# EAGLE design SensorInterface (EAGLE 7.6.0)

## Sheet 1 of 2
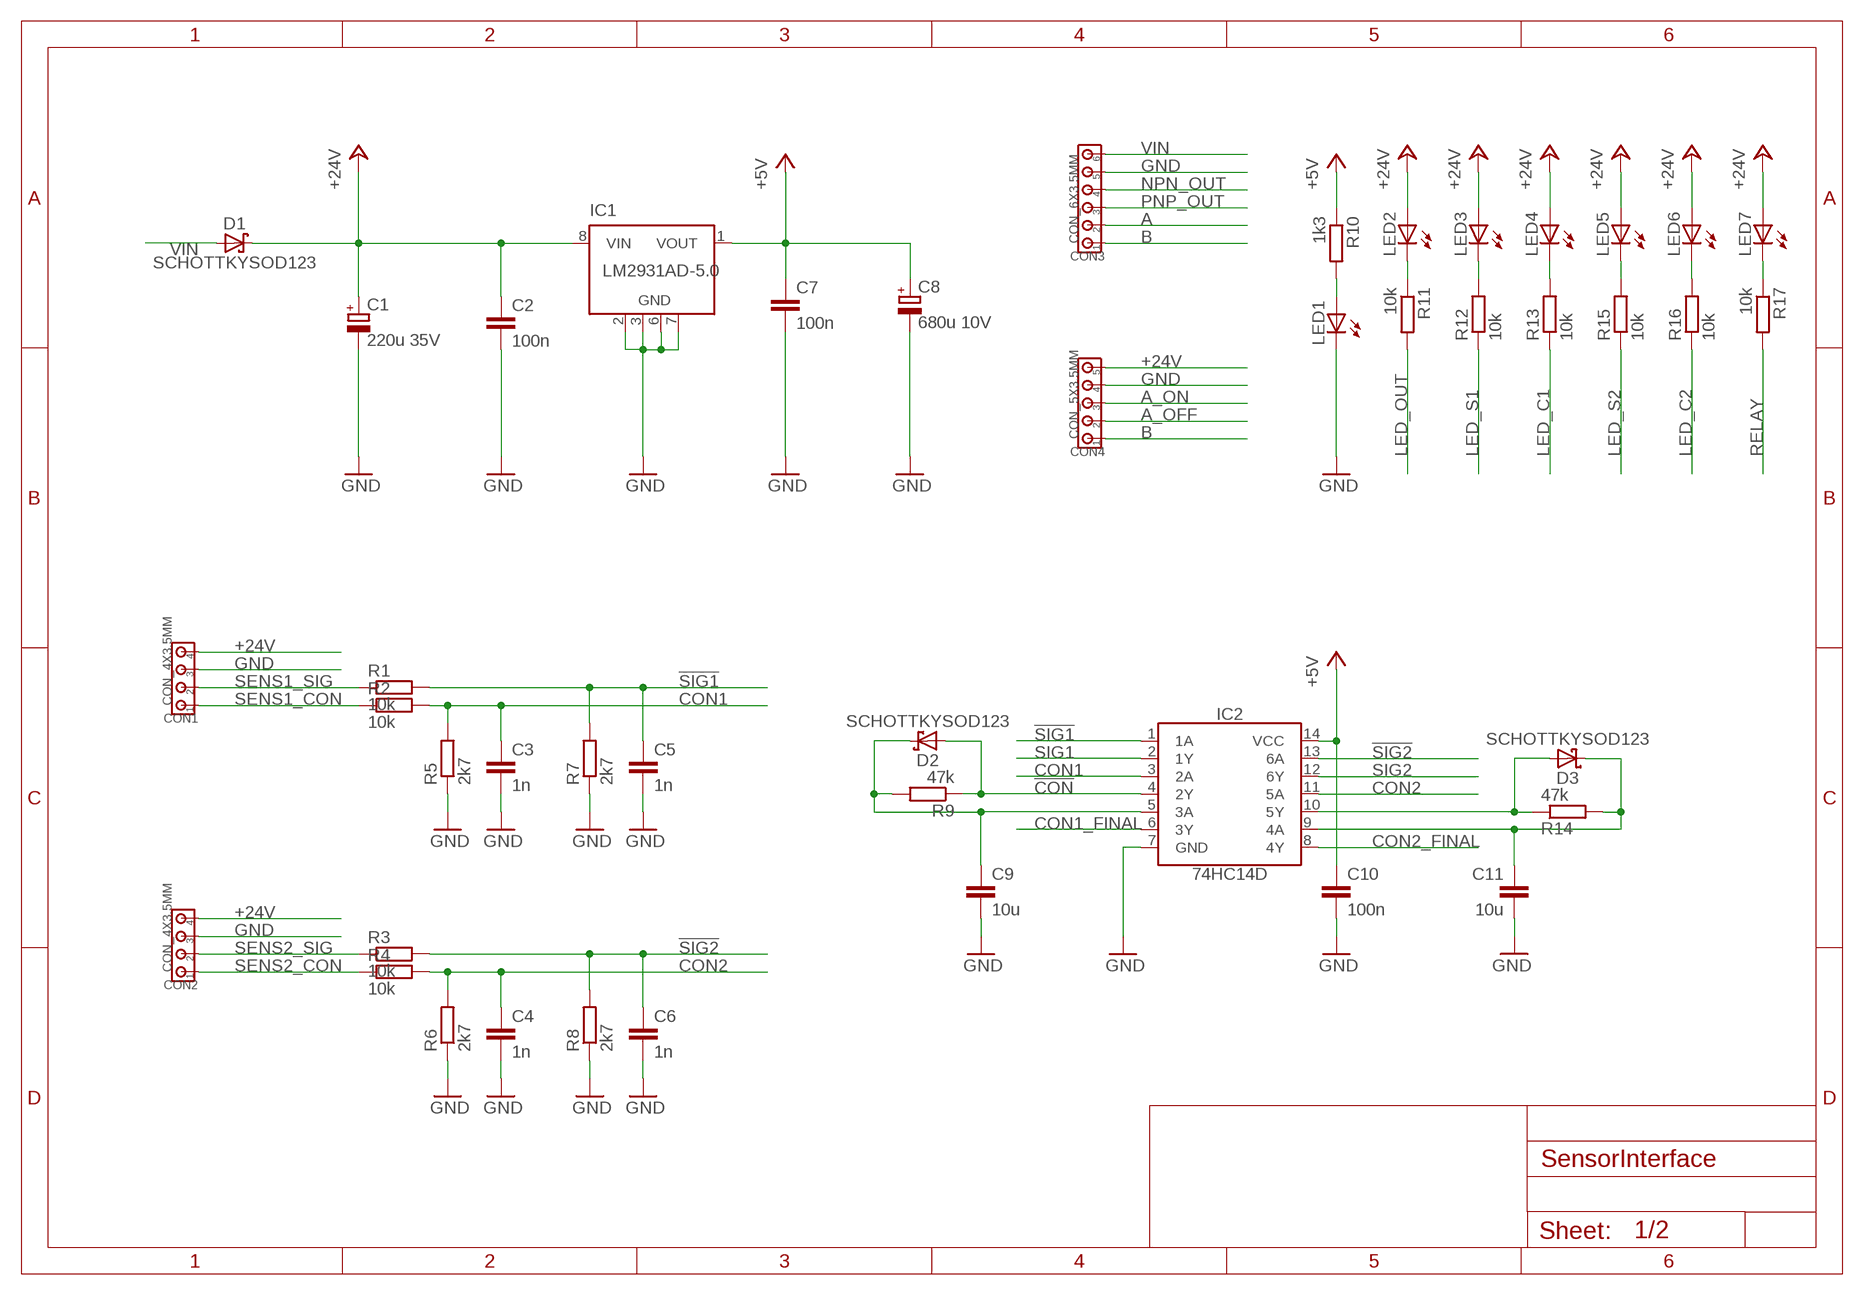
[diagram p0: schematic, sheet 1]

### Parts
C1  220u 35V  C_POLARIZED8MM  [8MM]
C2  100n  CC0805  [C0805]
C3  1n  CC0805  [C0805]
C4  1n  CC0805  [C0805]
C5  1n  CC0805  [C0805]
C6  1n  CC0805  [C0805]
C7  100n  CC0805  [C0805]
C8  680u 10V  C_POLARIZED8MM  [8MM]
C9  10u  CC0805  [C0805]
C10  100n  CC0805  [C0805]
C11  10u  CC0805  [C0805]
CON1  CON_4X3.5MM  [3.5MM_4X]
CON2  CON_4X3.5MM  [3.5MM_4X]
CON3  CON_6X3.5MM  [3.5MM_6X]
CON4  CON_5X3.5MM  [3.5MM_5X]
D1  SCHOTTKYSOD123  [SOD123]
D2  SCHOTTKYSOD123  [SOD123]
D3  SCHOTTKYSOD123  [SOD123]
IC1  LM2931AD-5.0  [SOIC8]
IC2  74HC14D  [SO14]
LED1  LED0805_NB  [LED0805_NOBOARDER]
LED2  LED0805_NB  [LED0805_NOBOARDER]
LED3  LED0805_NB  [LED0805_NOBOARDER]
LED4  LED0805_NB  [LED0805_NOBOARDER]
LED5  LED0805_NB  [LED0805_NOBOARDER]
LED6  LED0805_NB  [LED0805_NOBOARDER]
LED7  LED0805_NB  [LED0805_NOBOARDER]
R1  10k  RESISTORR0805  [R0805]
R2  10k  RESISTORR0805  [R0805]
R3  10k  RESISTORR0805  [R0805]
R4  10k  RESISTORR0805  [R0805]
R5  2k7  RESISTORR0805  [R0805]
R6  2k7  RESISTORR0805  [R0805]
R7  2k7  RESISTORR0805  [R0805]
R8  2k7  RESISTORR0805  [R0805]
R9  47k  RESISTORR0805  [R0805]
R10  1k3  RESISTORR0805  [R0805]
R11  10k  RESISTORR0805  [R0805]
R12  10k  RESISTORR0805  [R0805]
R13  10k  RESISTORR0805  [R0805]
R14  47k  RESISTORR0805  [R0805]
R15  10k  RESISTORR0805  [R0805]
R16  10k  RESISTORR0805  [R0805]
R17  10k  RESISTORR0805  [R0805]

### Nets
!CON!: D2.A IC2.4(2Y) R9.1
!CON!1: D3.A IC2.10(5Y) R14.1
!SIG1!: C5.1 IC2.1(1A) R1.2 R7.2 ; also sheet 2
!SIG2!: C6.1 IC2.13(6A) R3.2 R8.2 ; also sheet 2
+5V: C7.1 C8.+ C10.1 IC1.1(VOUT) IC2.14(VCC) R10.1 ; also sheet 2
+24V: C1.+ C2.1 CON1.4 CON2.4 CON4.5 D1.C IC1.8(VIN) LED2.A LED3.A LED4.A LED5.A LED6.A LED7.A ; also sheet 2
A: CON3.2 ; also sheet 2
A_OFF: CON4.2 ; also sheet 2
A_ON: CON4.3 ; also sheet 2
B: CON3.1 CON4.1
CON1: C3.1 IC2.3(2A) R2.2 R5.2
CON1_FINAL: IC2.6(3Y) ; also sheet 2
CON2: C4.1 IC2.11(5A) R4.2 R6.2
CON2_FINAL: IC2.8(4Y) ; also sheet 2
GND: C1.- C2.2 C3.2 C4.2 C5.2 C6.2 C7.2 C8.- C9.2 C10.2 C11.2 CON1.3 CON2.3 CON3.5 CON4.4 IC1.2(GND) IC1.3(GND) IC1.6(GND) IC1.7(GND) IC2.7(GND) LED1.C R5.1 R6.1 R7.1 R8.1 ; also sheet 2
LED_C1: R13.1 ; also sheet 2
LED_C2: R16.1 ; also sheet 2
LED_OUT: R11.2 ; also sheet 2
LED_S1: R12.1 ; also sheet 2
LED_S2: R15.1 ; also sheet 2
N$2: C11.1 D3.C IC2.9(4A) R14.2
N$4: C9.1 D2.C IC2.5(3A) R9.2
N$6: LED1.A R10.2
N$8: LED2.C R11.1
N$11: LED7.C R17.1
N$12: LED6.C R16.2
N$13: LED5.C R15.2
N$14: LED4.C R13.2
N$15: LED3.C R12.2
NPN_OUT: CON3.4 ; also sheet 2
PNP_OUT: CON3.3 ; also sheet 2
RELAY: R17.2 ; also sheet 2
SENS1_CON: CON1.1 R2.1
SENS1_SIG: CON1.2 R1.1
SENS2_CON: CON2.1 R4.1
SENS2_SIG: CON2.2 R3.1
SIG1: IC2.2(1Y) ; also sheet 2
SIG2: IC2.12(6Y) ; also sheet 2
VIN: CON3.6 D1.A

## Sheet 2 of 2
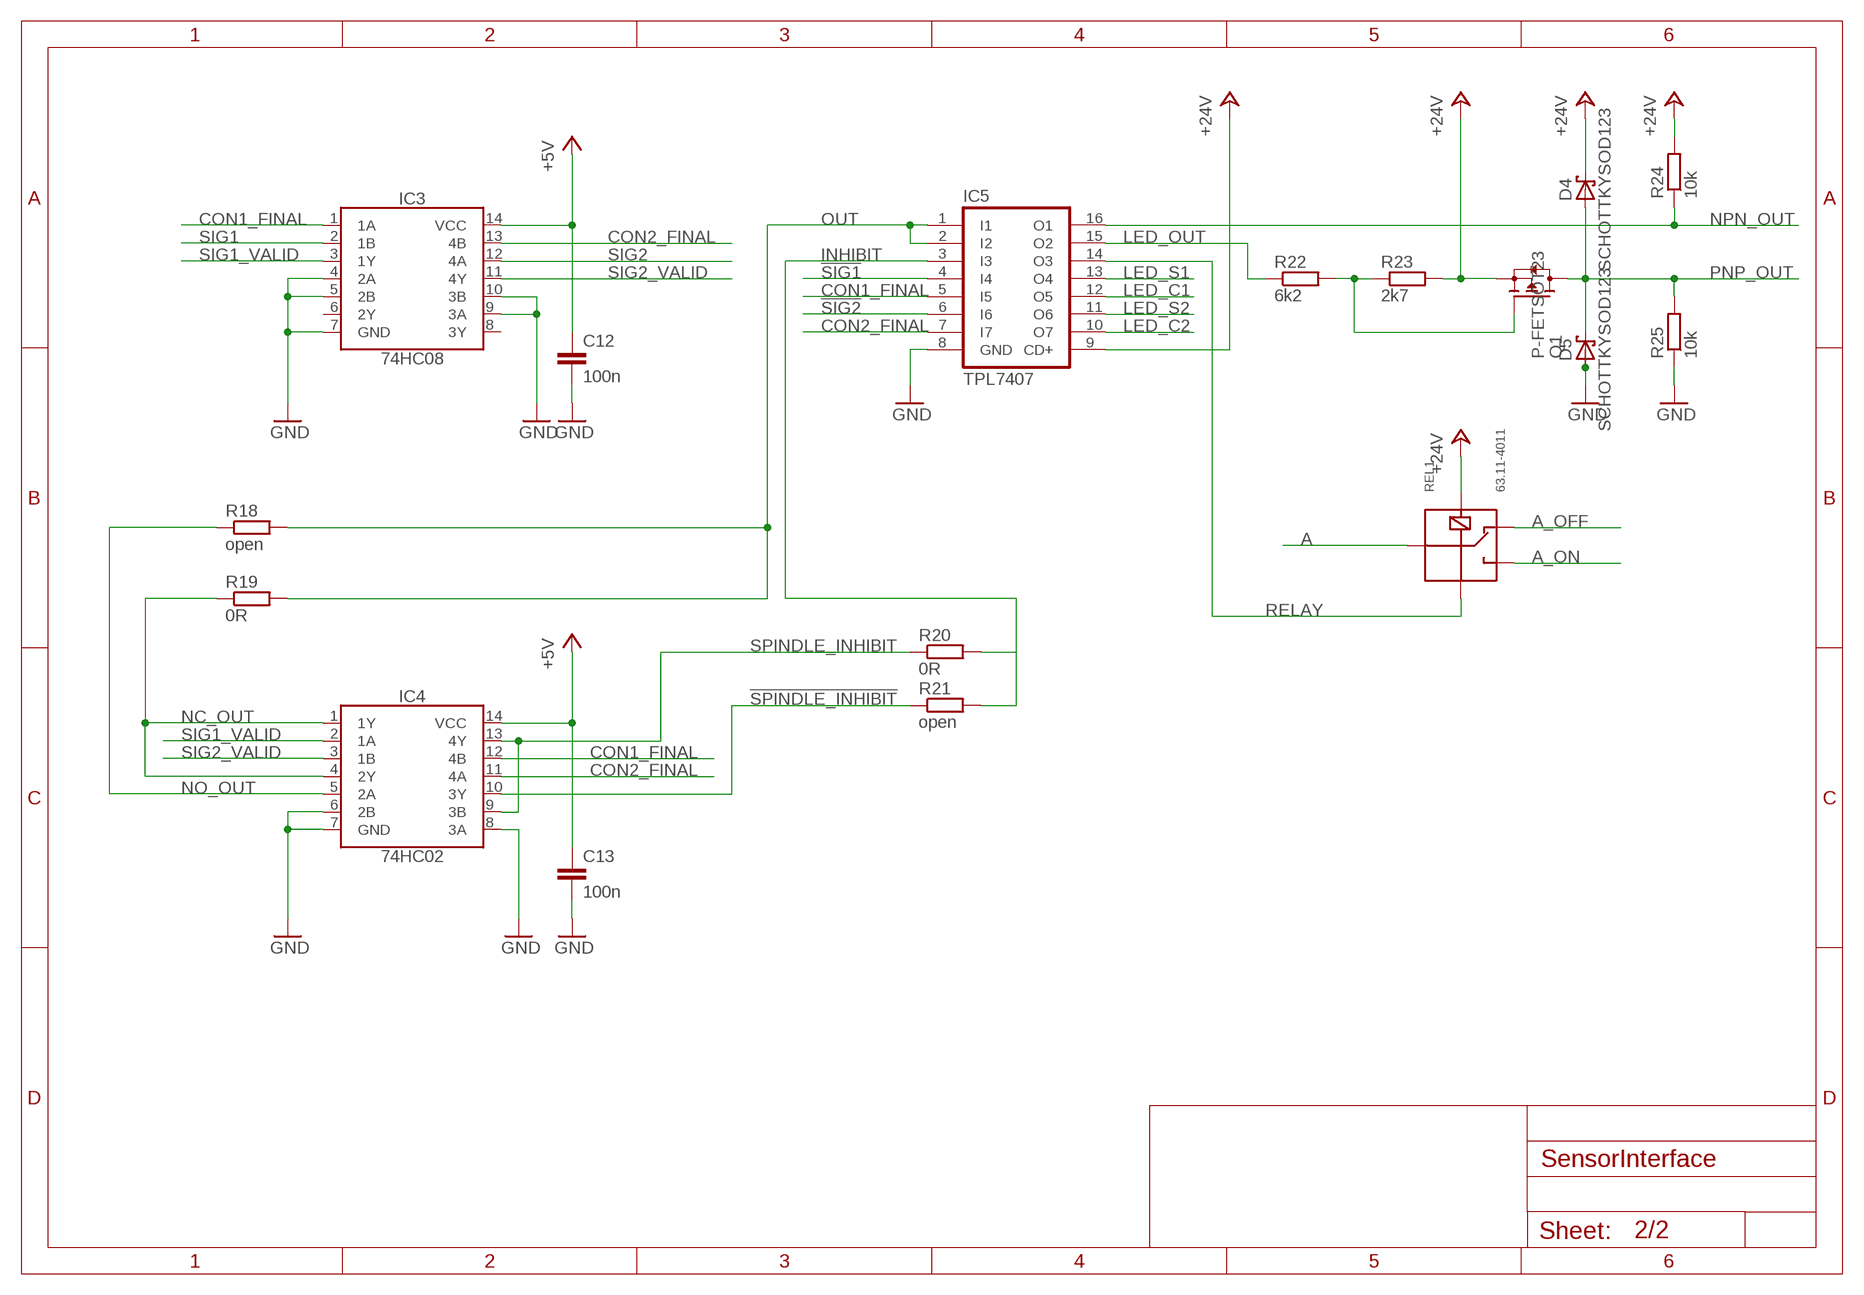
[diagram p1: schematic, sheet 2]

### Parts
C12  100n  CC0805  [C0805]
C13  100n  CC0805  [C0805]
D4  SCHOTTKYSOD123  [SOD123]
D5  SCHOTTKYSOD123  [SOD123]
IC3  74HC08  [SO14]
IC4  74HC02  [SO14]
IC5  TPL7407  ULN2003  [SO16]
Q1  P-FETSOT23  [SOT23]
R18  open  RESISTORR0805  [R0805]
R19  0R  RESISTORR0805  [R0805]
R20  0R  RESISTORR0805  [R0805]
R21  open  RESISTORR0805  [R0805]
R22  6k2  RESISTORR0805  [R0805]
R23  2k7  RESISTORR0805  [R0805]
R24  10k  RESISTORR0805  [R0805]
R25  10k  RESISTORR0805  [R0805]
REL1  63.11-4011  [G5LE]

### Nets
!SIG1!: IC5.4(I4) ; also sheet 1
!SIG2!: IC5.6(I6) ; also sheet 1
!SPINDLE_INHIBIT!: IC4.10(3Y) R21.1
+5V: C12.1 C13.1 IC3.14(VCC) IC4.14(VCC) ; also sheet 1
+24V: D4.C IC5.9(CD+) Q1.2(S) R23.2 R24.2 REL1.2 ; also sheet 1
A: REL1.COM ; also sheet 1
A_OFF: REL1.O ; also sheet 1
A_ON: REL1.C ; also sheet 1
CON1_FINAL: IC3.1(1A) IC4.12(4B) IC5.5(I5) ; also sheet 1
CON2_FINAL: IC3.13(4B) IC4.11(4A) IC5.7(I7) ; also sheet 1
GND: C12.2 C13.2 D5.A IC3.4(2A) IC3.5(2B) IC3.7(GND) IC3.9(3A) IC3.10(3B) IC4.6(2B) IC4.7(GND) IC4.8(3A) IC5.8(GND) R25.1 ; also sheet 1
INHIBIT: IC5.3(I3) R20.2 R21.2
LED_C1: IC5.12(O5) ; also sheet 1
LED_C2: IC5.10(O7) ; also sheet 1
LED_OUT: IC5.15(O2) R22.1 ; also sheet 1
LED_S1: IC5.13(O4) ; also sheet 1
LED_S2: IC5.11(O6) ; also sheet 1
N$5: Q1.1(G) R22.2 R23.1
NC_OUT: IC4.1(1Y) IC4.4(2Y) R19.1
NO_OUT: IC4.5(2A) R18.1
NPN_OUT: IC5.16(O1) R24.1 ; also sheet 1
OUT: IC5.1(I1) IC5.2(I2) R18.2 R19.2
PNP_OUT: D4.A D5.C Q1.3(D) R25.2 ; also sheet 1
RELAY: IC5.14(O3) REL1.1 ; also sheet 1
SIG1: IC3.2(1B) ; also sheet 1
SIG1_VALID: IC3.3(1Y) IC4.2(1A)
SIG2: IC3.12(4A) ; also sheet 1
SIG2_VALID: IC3.11(4Y) IC4.3(1B)
SPINDLE_INHIBIT: IC4.9(3B) IC4.13(4Y) R20.1
Unconnected: IC3.6(2Y) IC3.8(3Y)

## Library data of the parts
C1 C8 = 00Capacitor:C_POLARIZED
C2-C7 C9-C13 = 00Capacitor:C: Capacitor
CON1 CON2 = 00Connector:CON_4X: 4-pin header
CON3 = 00Connector:CON_6X: 6-pin header
CON4 = 00Connector:CON_5X: 5-pin header
D1-D5 = 00Diode:SCHOTTKY
IC1 = 00VoltageRegulator:LM2931*
IC2 = 00Logic:74HC14: Hex Inverter Schmitt Trigger
IC3 = 00Logic:74HC08: Quad 2-input AND gate
IC4 = 00Logic:74HC02: Quad NOR gate
IC5 = 00Transistor:ULN2003: Seven Darlington array
LED1-LED7 = 00Display:LED: LED
Q1 = 00Mosfet:P-FET
R1-R25 = 00Resistor:RESISTOR: RESISTOR, European symbol
REL1 = 00Switch:63.11-4011: SPDT Relay

## Net classes
1 24V: clearance 0.305 mm
5 +5v: width 0.61 mm, drill 0.6 mm, clearance 0.254 mm to class 0, clearance 0.254 mm to class 1, clearance 0.254 mm to class 2, clearance 0.254 mm to class 3, clearance 0.254 mm to class 4, clearance 0.254 mm

## Board
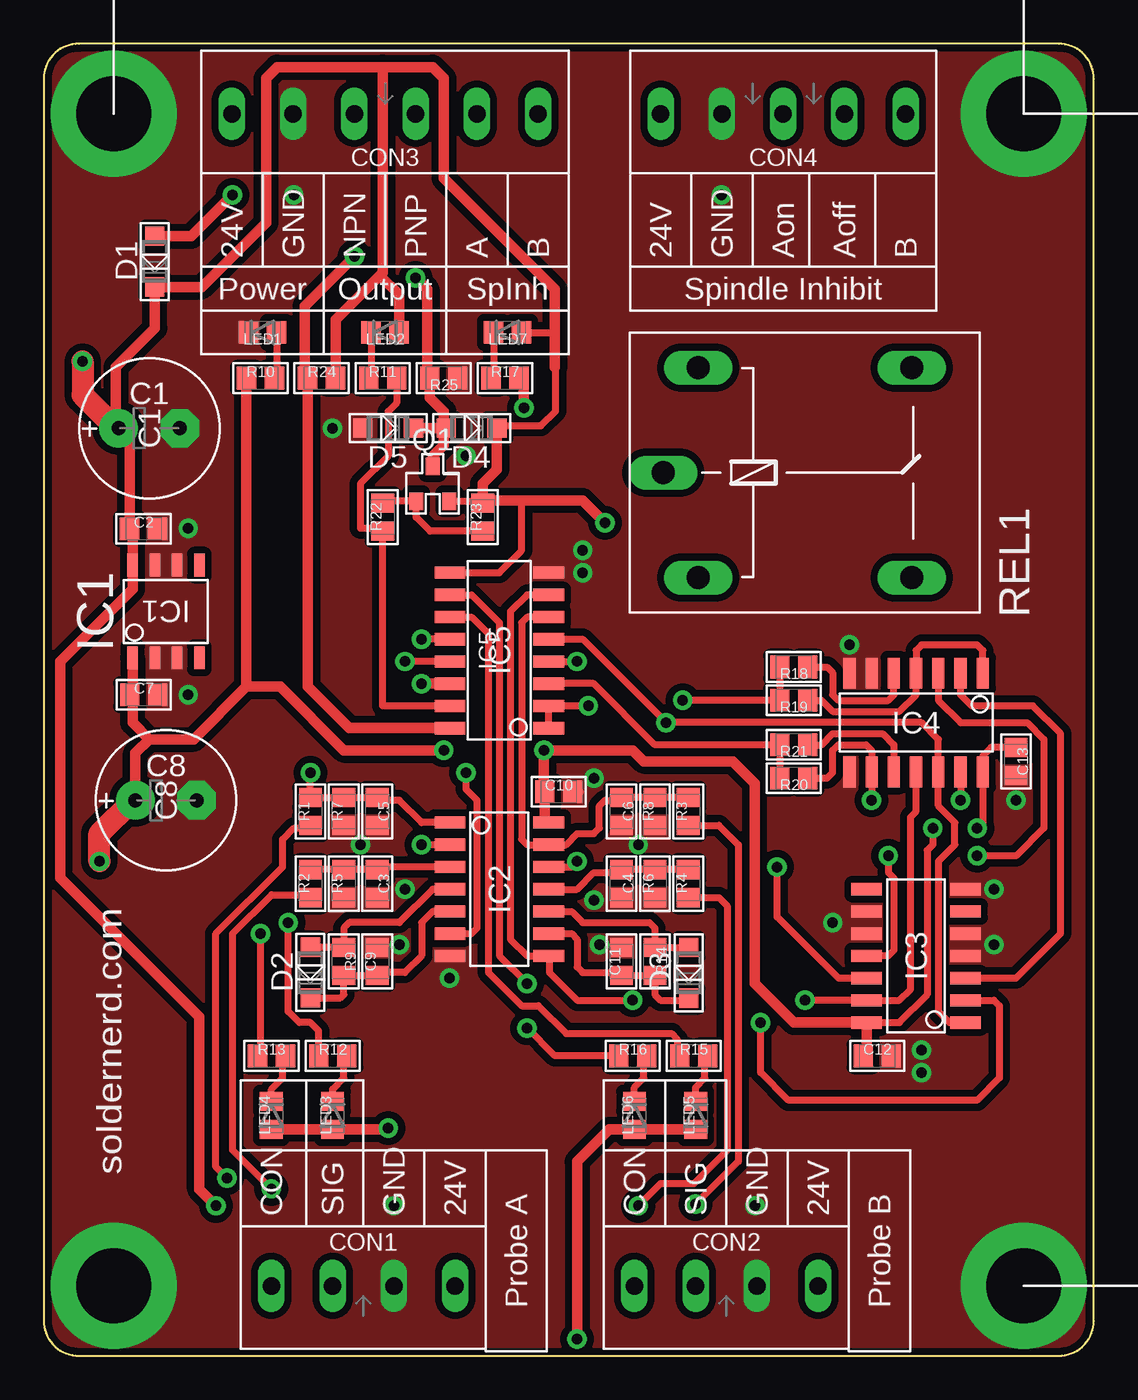
[diagram p2: board, top side]
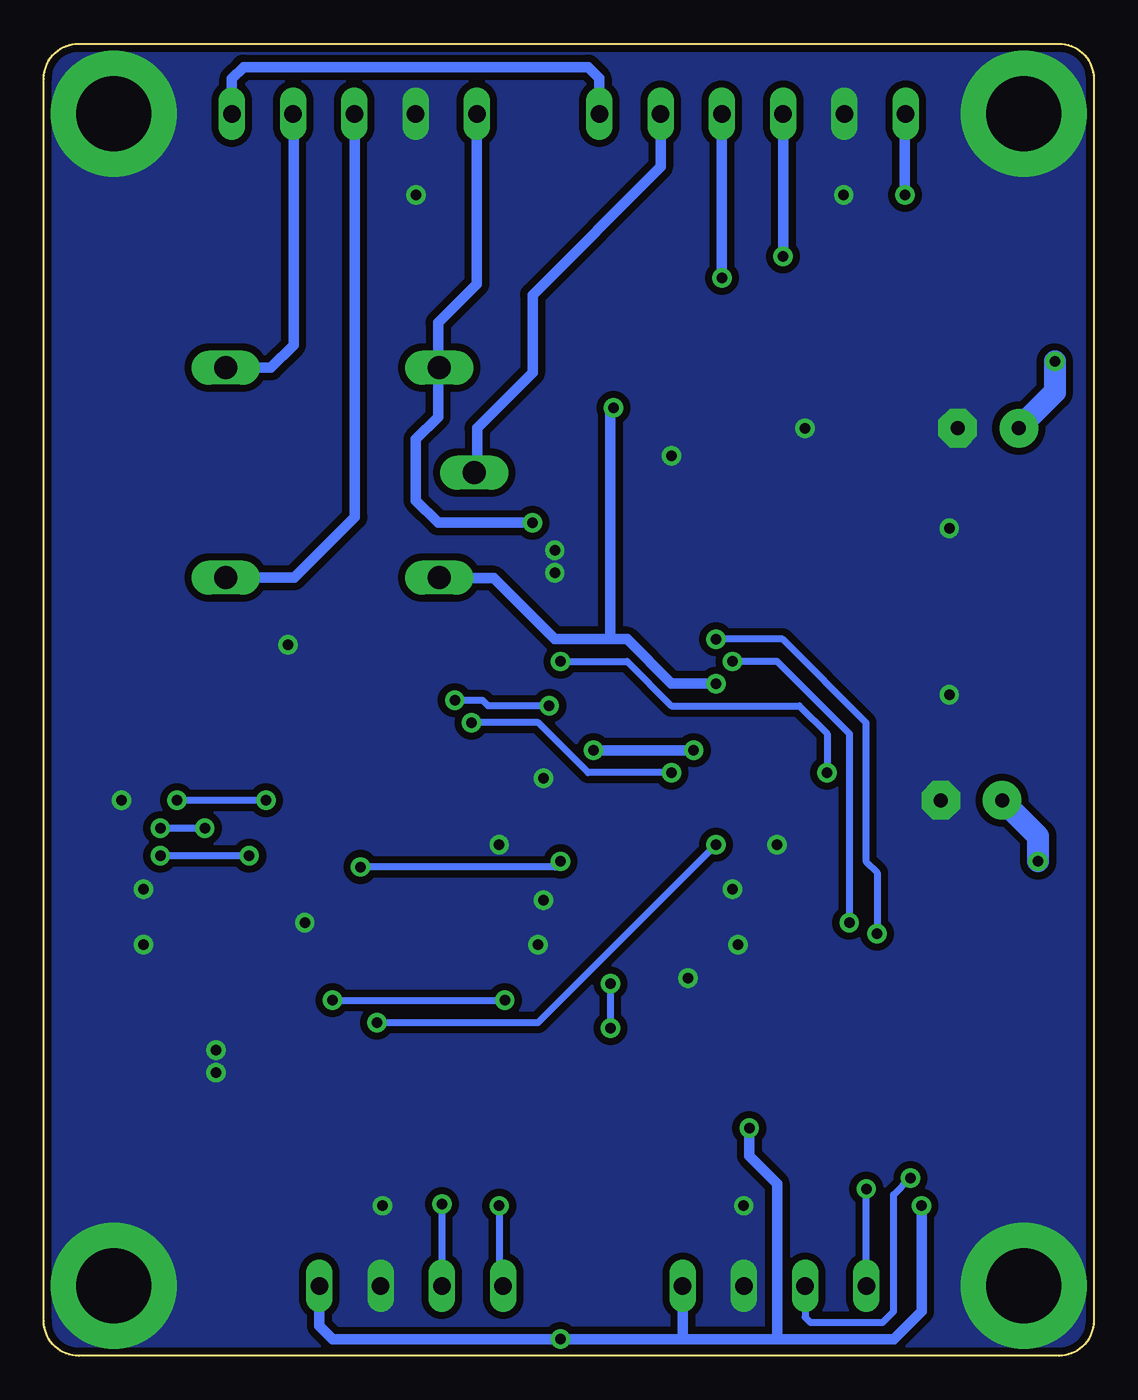
[diagram p3: board, bottom side, seen from below]

Size 60 x 75 mm. Coordinates in mm from the lower left corner, seen from the top.
Outline: 58,0 arc90 60,2 60,73 arc90 58,75 2,75 arc90 0,73 0,2 arc90 2,0 58,0
Copper layers (1*16): Top 0.035mm / dielectric 1.5mm / Bottom 0.035mm
Design rules "LPKF_Compatible": minimum track width 8mil, minimum drill 23mil, track to track 8mil, track to pad 8mil, pad to pad 8mil, via to via 8mil, smd to smd 0mil, copper to edge 10mil, drill to drill 10mil, minimum pad ring 10mil, minimum via ring 10mil, stop-mask expansion 2mil, vias tented up to drill 25mil, thermal gap 10mil

### Footprints (pad centres in the part's own frame; a part is rotated, then mirrored left to right if it is on the bottom)
8MM = drill 0.8 pad 2.2: + -1.75,0 | drill 0.8 pad 2.2 octagon: - 1.75,0
C0805 = smd 1.1 x 1.3: 1 -0.8,0; 2 0.8,0
3.5MM_4X = drill 1 long: 1 -5.25,0; 2 -1.75,0; 3 1.75,0; 4 5.25,0
3.5MM_6X = drill 1 long: 1 -8.75,0; 2 -5.25,0; 3 -1.75,0; 4 1.75,0; 5 5.25,0; 6 8.75,0
3.5MM_5X = drill 1 long: 1 -7,0; 2 -3.5,0; 3 0,0; 4 3.5,0; 5 7,0
SOD123 = smd 1.1 x 1.1: A 1.45,0; C -1.45,0
SOIC8 = smd 1.3 x 0.6: 1 -2.65,1.905; 2 -2.65,0.635; 3 -2.65,-0.635; 4 -2.65,-1.905; 5 2.65,-1.905; 6 2.65,-0.635; 7 2.65,0.635; 8 2.65,1.905
SO14 = smd 0.7 x 1.75: 1 -3.81,-2.825; 2 -2.54,-2.825; 3 -1.27,-2.825; 4 0,-2.825; 5 1.27,-2.825; 6 2.54,-2.825; 7 3.81,-2.825; 8 3.81,2.825; 9 2.54,2.825; 10 1.27,2.825; 11 0,2.825; 12 -1.27,2.825; 13 -2.54,2.825; 14 -3.81,2.825
SO16 = smd 0.7 x 1.75: 1 -4.445,-2.825; 2 -3.175,-2.825; 3 -1.905,-2.825; 4 -0.635,-2.825; 5 0.635,-2.825; 6 1.905,-2.825; 7 3.175,-2.825; 8 4.445,-2.825; 9 4.445,2.825; 10 3.175,2.825; 11 1.905,2.825; 12 0.635,2.825; 13 -0.635,2.825; 14 -1.905,2.825; 15 -3.175,2.825; 16 -4.445,2.825
LED0805_NOBOARDER = smd 1.1 x 1.3: A -0.8,0; C 0.8,0
SOT23 = smd 0.8 x 1: 1 -0.95,-1; 2 0.95,-1; 3 0,1
R0805 = smd 1.1 x 1.3: 1 -0.8,0; 2 0.8,0
G5LE = drill 1.3 long: 1 -6.1,-6; 2 -6.1,6; C 6.1,-6; COM -8.1,0; O 6.1,6

### Placement (x,y rotation side)
C1  6.03,53.02 0 top
C2  5.7,47.27 0 top
C3  19.05,26.99 270 top
C4  33.02,26.99 270 top
C5  19.05,31.11 270 top
C6  33.02,31.11 270 top
C7  5.71,37.78 0 top
C8  6.99,31.75 0 top
C9  19.05,22.54 90 top
C10  29.43,32.24 0 top
C11  33.02,22.54 90 top
C12  47.62,17.14 0 top
C13  55.56,33.97 270 top
CON1  18.25,4 0 top
CON2  39,4 0 top
CON3  19.5,71 180 top
CON4  42.25,71 180 top
D1  6.35,62.55 90 top
D2  15.24,21.91 90 top
D3  36.85,21.9 90 top
D4  24.45,53.02 180 top
D5  19.68,53.02 180 top
IC1  6.99,42.55 90 top
IC2  26.04,26.67 270 top
IC3  49.85,22.86 90 top
IC4  49.85,36.2 180 top
IC5  26.04,40.32 90 top
LED1  12.5,58.5 180 top
LED2  19.5,58.5 180 top
LED3  16.5,13.75 90 top
LED4  13,13.75 90 top
LED5  37.25,13.75 90 top
LED6  33.75,13.75 90 top
LED7  26.5,58.5 180 top
Q1  22.23,49.85 0 top
R1  15.24,31.11 90 top
R2  15.24,26.99 90 top
R3  36.83,31.11 90 top
R4  36.83,26.99 90 top
R5  17.14,26.99 90 top
R6  34.92,26.99 90 top
R7  17.14,31.11 90 top
R8  34.92,31.11 90 top
R9  17.14,22.54 270 top
R10  12.38,55.88 0 top
R11  19.37,55.88 0 top
R12  16.51,17.14 0 top
R13  13.02,17.14 0 top
R14  34.92,22.54 270 top
R15  37.15,17.14 0 top
R16  33.66,17.14 0 top
R17  26.35,55.88 0 top
R18  42.86,39.37 180 top
R19  42.86,37.47 180 top
R20  42.86,33.02 180 top
R21  42.86,34.92 180 top
R22  19.37,47.94 90 top
R23  25.08,47.94 90 top
R24  15.88,55.88 0 top
R25  22.86,55.88 180 top
REL1  43.5,50.48 0 top

### Tracks (layer width: path | path; a pad name or v marks a point on that pad's centre or on a via)
!CON!
  Top 0.406: IC2.4 22.23,26.67 20.32,24.77 17.46,24.77 17.14,24.45 R9.1 15.26,23.34 D2.A
!CON!1
  Top 0.406: D3.A R14.1 34.92,24.45 34.61,24.77 30.8,24.77 30.16,25.4 IC2.10
!SIG1!  (via drill 0.6)
  Top 0.406: IC5.4 v30.48,39.69 | v15.24,33.34 R1.2 R7.2 C5.1 19.21,31.75 20.32,31.75 21.59,30.48 IC2.1
  Bottom 0.406: v30.48,39.69 26.67,39.69 24.13,37.15 16.83,37.15 15.24,35.56 v15.24,33.34
!SIG2!
  Top 0.406: R3.2 R8.2 C6.1 32.85,31.75 32.07,31.75 31.75,31.43 31.75,30.16 31.43,29.84 30.48,29.84 29.84,29.21 IC2.13 27.62,29.21 27.3,29.53 27.3,41.91 27.62,42.23 IC5.6
!SPINDLE_INHIBIT!
  Top 0.406: R21.1 44.45,34.92 45.09,35.56 47.94,35.56 48.58,34.92 IC4.10
+5V  (via drill 0.6)
  Top 0.406: 28.32,30.54 28.26,30.48 IC2.14 | 53.78,33.49 IC4.14 | C13.1 54.14,34.77 53.66,34.29 IC4.14 | v50.8,30.16 50.8,29.21 50.48,28.89 50.48,20.64 48.9,19.05 IC3.14 | IC4.14 53.66,30.48 v53.34,30.16
  Top 0.61: R10.1 11.58,38.25 | 11.58,38.25 8.57,35.24 6.03,35.24 | 11.58,38.25 13.5,38.25 17.14,34.61 v22.86,34.61 | C12.1 47.02,17.34 IC3.14 42.86,19.05 40.64,21.27 40.64,32.7 39.37,33.97 34.29,33.97 33.66,34.61 v28.57,34.61 28.57,32.3 C10.1 28.63,30.71 IC2.14 | C8.+ 5.24,34.45 6.03,35.24 | 6.03,35.24 5.08,36.2 5.08,37.62 C7.1 5.08,37.95 IC1.1
  Top 1.27: v3.17,28.26 3.17,29.84 5.08,31.75
  Bottom 0.406: v53.34,30.16 v50.8,30.16
  Bottom 0.61: v22.86,34.61 v28.57,34.61
  Bottom 1.27: v3.17,28.26 3.17,29.69 C8.+
+24V  (via drill 0.6)
  Top 0.406: Q1.2 24.98,48.85 R23.2 | IC5.9 26.04,44.77 27.3,46.04 27.3,48.9 | LED7.A 29.21,58.5 | 26.04,53.16 28.41,53.16 29.25,54 29.25,56.48 29.21,56.52
  Top 0.61: 26.04,53.16 D4.C 25.9,50.66 25.08,49.85 R23.2 25.23,48.9 27.3,48.9 30.8,48.9 v32.07,47.62 | 19.37,73.66 13.34,73.66 12.7,73.03 12.7,64.77 9.03,61.1 D1.C 6.35,58.74 4.13,56.52 4.13,53.18 C1.+ 4.9,52.41 C2.1 | 19.37,73.66 22.23,73.66 22.86,73.03 22.86,67.31 29.21,60.96 29.21,58.5 29.21,56.52 | 4.79,47.17 C2.1 | 19.37,73.66 19.37,61.91 19.21,61.75 | 19.21,61.75 16.68,59.22 R24.2 | 33.66,12.86 LED6.A | LED2.A 20.3,60.66 19.21,61.75 | v9.84,8.57 8.89,9.53 8.89,19.37 0.95,27.3 0.95,39.69 5.08,43.81 IC1.8 5.08,47.09 C2.1 | LED6.A 32.32,12.95 30.48,11.11 v30.48,0.95 | LED6.A LED5.A | LED4.A LED3.A 19.62,12.95 v19.68,13.02
  Top 1.27: v2.22,56.83 2.22,54.93 4.13,53.02
  Bottom 0.406: 23.5,0.95 23.5,0.96
  Bottom 0.61: CON4.5 35.25,61.27 37.47,59.05 37.47,56.55 REL1.2 37.47,56.41 37.47,53.66 38.73,52.39 38.73,48.9 37.47,47.62 v32.07,47.62 | CON2.4 44.25,1.71 43.5,0.95 v30.48,0.95 23.5,0.95 18.1,0.95 | 18.1,0.95 11.43,0.95 9.84,2.54 v9.84,8.57 | CON1.4 23.5,0.96 | v19.68,13.02 19.68,11.43 18.1,9.84 18.1,0.95
  Bottom 1.27: v2.22,56.83 2.22,55.08 C1.+
A
  Bottom 0.61: CON3.2 24.75,67.96 32.07,60.64 32.07,56.2 35.24,53.02 35.24,50.64 REL1.COM
A_OFF
  Bottom 0.61: REL1.O 47.02,56.48 45.72,57.78 45.72,70.97 CON4.2
A_ON
  Bottom 0.61: REL1.C 45.69,44.48 42.23,47.94 42.23,70.98 CON4.3
B
  Bottom 0.61: CON4.1 49.25,72.99 48.58,73.66 28.89,73.66 28.26,73.03 CON3.1
CON1
  Top 0.406: R2.2 R5.2 C3.1 19.2,27.94 IC2.3
CON1_FINAL  (via drill 0.6)
  Top 0.406: IC2.6 24.45,24.13 24.77,24.45 24.77,31.75 24.13,32.38 v24.13,33.34 | IC3.1 51.75,19.05 51.12,19.68 51.12,28.26 52.07,29.21 52.07,30.48 51.12,31.43 IC4.12 51.12,35.24 50.16,36.2 v35.56,36.2 30.8,40.96 IC5.5
  Bottom 0.406: v24.13,33.34 28.89,33.34 31.75,36.2 v35.56,36.2
CON2
  Top 0.406: R4.2 R6.2 C4.1 32.85,27.62 31.43,27.62 30.48,26.67 IC2.11
CON2_FINAL  (via drill 0.6)
  Top 0.406: IC5.7 27.62,43.5 26.67,42.55 26.67,23.81 27.62,22.86 IC2.8 28.89,22.83 28.89,21.91 30.48,20.32 v33.66,20.32 | IC4.11 49.85,31.11 49.53,30.8 49.53,20.95 48.9,20.32 IC3.13 v43.5,20.32
  Bottom 0.406: v43.5,20.32 v33.66,20.32
GND  (via drill 0.6, 4.3 pad 7.2)
  Top 0.406: C10.2 30.66,32.24
  other vias: 4,71 56,71 56,4 4,4 33.97,29.21 31.43,26.04 54.29,23.5 16.51,53.02 55.56,31.75 24.13,51.44 50.16,17.46 50.16,16.19 30.8,44.77 20.64,26.67 18.1,29.21 23.18,21.59 45.09,24.77 31.75,23.5 20.32,23.5 46.04,40.64 54.29,26.67 31.43,33.02 8.26,47.31 8.26,37.78 30.8,46.04 14.29,66.36 40.64,8.57 20,8.57 38.73,66.36
  pour Bottom (isolate 0.406, rank 3, no thermals): 58,0 2,0 arc-90 0,2 0,73 arc-90 2,75 58,75 arc-90 60,73 60,2 arc-90
  pour Top (isolate 0.406, rank 3, no thermals): 0,2 0,73 arc-90 2,75 58,75 arc-90 60,73 60,2 arc-90 58,0 2,0 arc-90
INHIBIT
  Top 0.406: R20.2 R21.2 34.92,34.92 31.43,38.42 IC5.3
LED_C1  (via drill 0.6)
  Top 0.406: IC5.12 v21.59,40.96 | v12.38,24.13 12.38,17.31 R13.1
  Bottom 0.406: v12.38,24.13 12.38,27.62 13.02,28.26 13.02,36.2 17.78,40.96 v21.59,40.96
LED_C2  (via drill 0.6)
  Top 0.406: IC5.10 24.45,43.5 26.04,41.91 26.04,22.86 v27.62,21.27 | R16.1 29.21,17.14 v27.62,18.73
  Bottom 0.406: v27.62,21.27 v27.62,18.73
LED_OUT
  Top 0.406: R11.2 20.17,54.46 19.68,53.98 19.68,51.44 18.1,49.85 18.1,47.31 19.2,47.31 R22.1 19.37,37.15 IC5.15
LED_S1  (via drill 0.6)
  Top 0.406: IC5.13 v20.64,39.69 | R12.1 15.71,18.58 15.24,19.05 14.61,19.05 13.97,19.68 v13.97,24.77
  Bottom 0.406: v13.97,24.77 13.97,35.56 18.1,39.69 v20.64,39.69
LED_S2
  Top 0.406: IC5.11 24.45,42.23 25.4,41.27 25.4,21.91 27.3,20 28.26,20 29.84,18.41 35.88,18.41 36.2,18.1 36.2,17.3 R15.1
N$2
  Top 0.406: IC2.9 30.16,24.13 30.48,23.81 30.48,22.23 30.8,21.91 32.85,21.91 C11.1 R14.2 34.92,20.64 35.24,20.32 36.72,20.32 D3.C
N$4
  Top 0.406: IC2.5 22.23,25.4 21.59,24.77 21.59,22.86 20.64,21.91 19.21,21.91 C9.1 R9.2 17.14,20.64 16.96,20.46 D2.C
N$5
  Top 0.406: R22.2 19.47,48.85 Q1.1 21.27,47.94 22.07,47.14 R23.1
N$6
  Top 0.406: LED1.A 13.3,56 R10.2
N$8
  Top 0.406: LED2.C 18.7,56.01 R11.1
N$11
  Top 0.406: LED7.C 25.7,56.03 R17.1
N$12
  Top 0.406: LED6.C 33.75,15.34 34.29,15.88 34.29,16.98 R16.2
N$13
  Top 0.406: LED5.C 37.25,15.34 37.78,15.88 37.78,16.98 R15.2
N$14
  Top 0.406: LED4.C 13,15.22 13.65,15.88 13.65,16.98 R13.2
N$15
  Top 0.406: LED3.C 16.5,15.23 17.14,15.88 17.14,16.98 R12.2
NC_OUT
  Top 0.406: IC4.1 53.66,40.32 53.34,40.64 50.16,40.64 49.85,40.32 IC4.4 49.85,37.78 48.9,36.83 45.09,36.83 44.45,37.47 R19.1
NO_OUT
  Top 0.406: R18.1 44.77,39.37 45.09,39.05 45.09,37.78 45.4,37.47 48.26,37.47 48.58,37.78 IC4.5
NPN_OUT  (via drill 0.6)
  Top 0.61: v17.75,62.84 14.92,60.01 14.92,56.03 | R24.1 15.07,38.27 17.46,35.88 IC5.16
  Top 0.813: 14.92,56.03 R24.1
  Bottom 0.61: CON3.4 v17.75,62.84
OUT  (via drill 0.6)
  Top 0.406: R18.2 R19.2 v36.51,37.47 | IC5.1 IC5.2 v31.11,37.15
  Bottom 0.406: v31.11,37.15 34.61,37.15 34.92,37.47 v36.51,37.47
PNP_OUT  (via drill 0.6)
  Top 0.61: v21.25,61.62 21.91,60.96 21.91,56.03 | D5.C D4.A | Q1.3 22.23,51.44 22.86,52.07 22.86,52.88 D4.A | R25.2 22.06,54.77 22.86,53.98 22.86,53.16 D4.A
  Top 0.813: 21.91,56.03 R25.2
  Bottom 0.61: CON3.3 v21.25,61.62
RELAY  (via drill 0.6)
  Top 0.406: 27.43,55.6 R17.2
  Top 0.61: IC5.14 v21.59,38.42 | v27.43,54.18 27.43,55.6
  Bottom 0.61: REL1.1 37.37,44.45 34.29,44.45 30.8,40.96 27.62,40.96 | v21.59,38.42 24.13,38.42 26.67,40.96 27.62,40.96 | v27.43,54.18 27.62,53.99 27.62,40.96
SENS1_CON  (via drill 0.6)
  Top 0.406: v13,9.54 10.79,11.75 10.79,24.13 13.02,26.35 15.07,26.35 R2.1
  Bottom 0.406: CON1.1 v13,9.54
SENS1_SIG  (via drill 0.6)
  Top 0.406: v10.48,10.16 9.84,10.79 9.84,24.13 13.65,27.94 13.65,29.53 14.29,30.16 15.09,30.16 R1.1
  Bottom 0.406: CON1.2 16.5,2.21 16.19,1.91 12.06,1.91 11.43,2.54 11.43,9.21 v10.48,10.16
SENS2_CON  (via drill 0.6)
  Top 0.406: R4.1 38.58,26.19 39.05,25.72 39.05,11.75 37.15,9.84 35.24,9.84 v33.97,8.57
  Bottom 0.406: v33.97,8.57 33.97,4.22 CON2.1
SENS2_SIG  (via drill 0.6)
  Top 0.406: R3.1 38.58,30.32 39.69,29.21 39.69,11.11 v37.25,8.68
  Bottom 0.406: v37.25,8.68 CON2.2
SIG1  (via drill 0.6)
  Top 0.406: IC2.2 v21.59,29.21 | v40.96,19.05 40.96,16.19 42.55,14.61 53.34,14.61 54.61,15.88 54.61,20 54.29,20.32 IC3.2
  Bottom 0.406: v40.96,19.05 31.75,19.05 v21.59,29.21
SIG1_VALID
  Top 0.406: IC4.2 52.39,37.78 53.02,37.15 56.52,37.15 58.1,35.56 58.1,24.13 55.56,21.59 IC3.3
SIG2  (via drill 0.6)
  Top 0.406: IC2.12 30.16,27.94 v30.48,28.26 | v41.91,27.94 41.91,25.08 45.4,21.59 IC3.12
  Bottom 0.406: v30.48,28.26 30.8,27.94 v41.91,27.94
SIG2_VALID  (via drill 0.6)
  Top 0.406: IC4.3 51.12,37.47 52.39,36.2 56.2,36.2 57.15,35.24 57.15,30.16 55.56,28.57 v53.34,28.57 | v48.26,28.57 48.26,27.62 48.58,27.3 48.58,23.18 48.26,22.86 IC3.11
  Bottom 0.406: v48.26,28.57 v53.34,28.57
SPINDLE_INHIBIT  (via drill 0.6)
  Top 0.406: v47.31,31.75 IC4.9 47.31,34.61 46.99,34.92 45.4,34.92 45.09,34.61 45.09,33.34 44.77,33.02 R20.1 | IC4.13 v52.39,31.75
  Bottom 0.406: v47.31,31.75 v52.39,31.75
VIN  (via drill 0.6)
  Top 0.61: D1.A 8.44,64 v10.79,66.36
  Bottom 0.61: v10.79,66.36 10.79,70.95 CON3.6

### Text on the board
tPlace: 24V | GND | NPN | PNP | A | B | 24V | GND | Aon | Aoff | B | Power | Output | SpInh | Spindle Inhibit | soldernerd.com | CON | SIG | GND | 24V | CON | SIG | GND | 24V | Probe A | Probe B